# Altium schematic sheet Pyro.SchDoc
size C; SheetNumber: 5; SheetTotal: 7
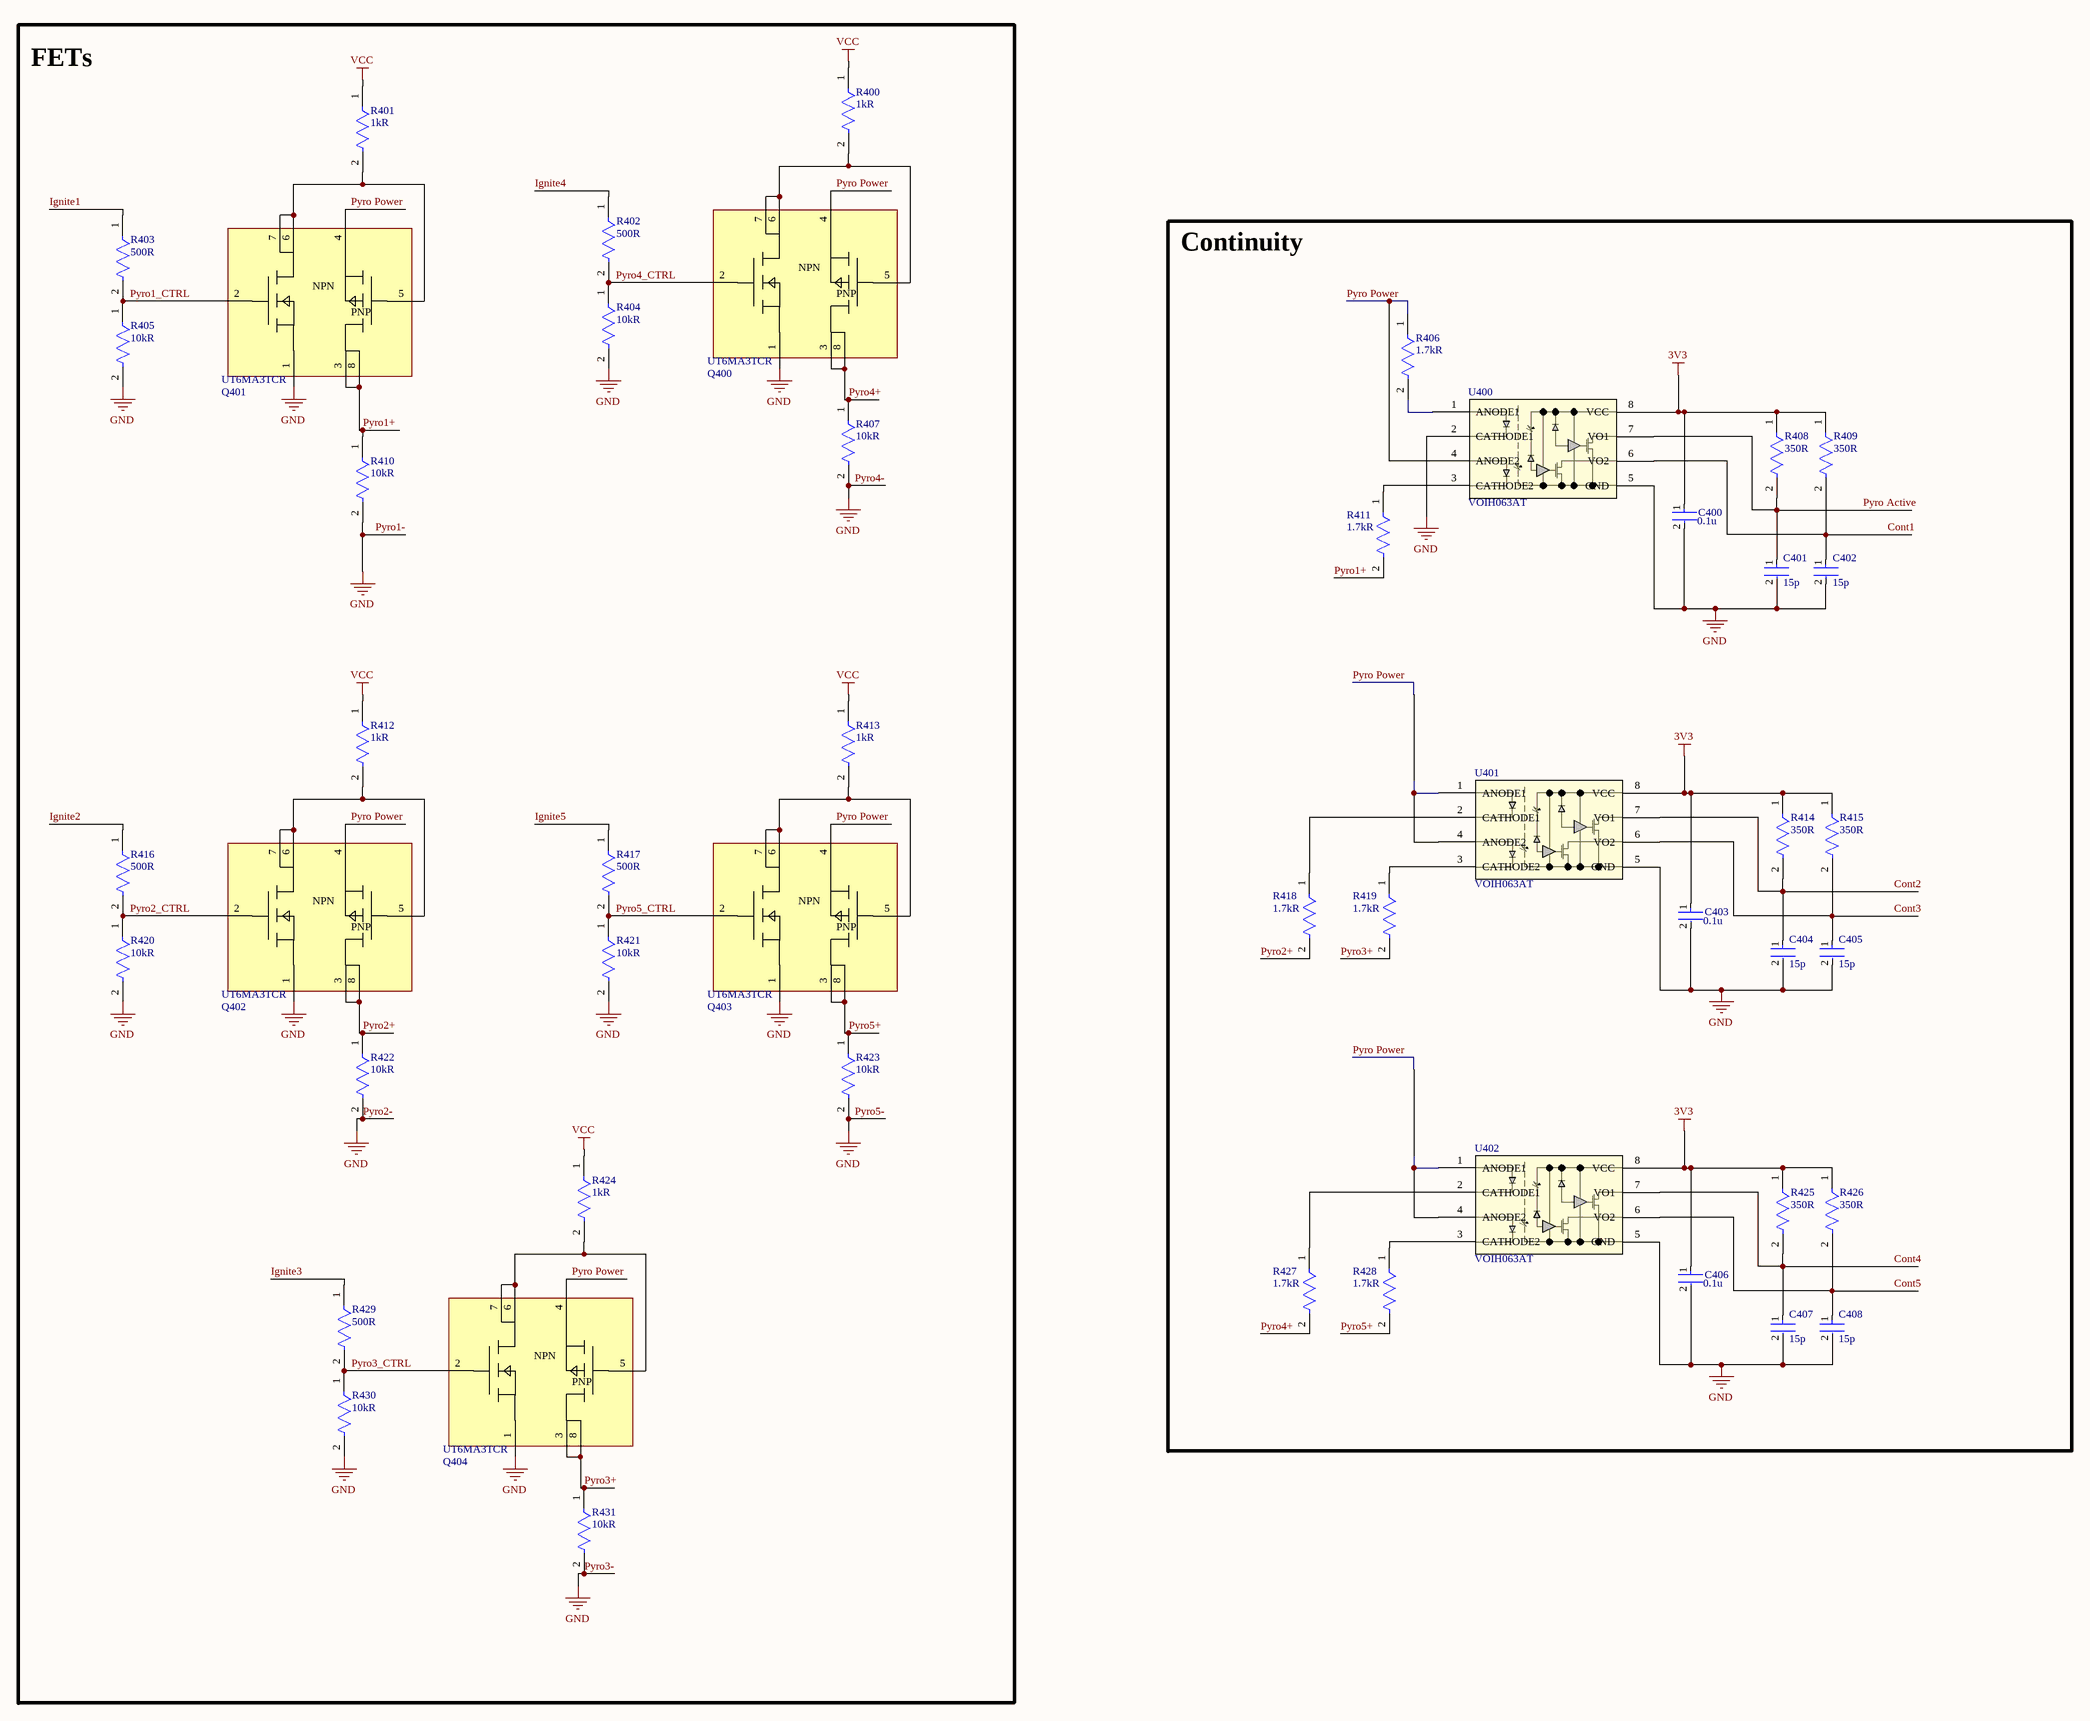
[diagram p0: Pyro.SchDoc]

## Parts
C400  Capacitance: 0.1u  [FP-CL94-IPC_C]  (hidden comment: CL05B104KQ5NNNC)
C401  Capacitance: 15p  [FP-CL10-IPC_A]  (hidden comment: CL10C681JB8NFNC)
C402  Capacitance: 15p  [FP-CL10-IPC_A]  (hidden comment: CL10C681JB8NFNC)
C403  Capacitance: 0.1u  [FP-CL94-IPC_C]  (hidden comment: CL05B104KQ5NNNC)
C404  Capacitance: 15p  [FP-CL10-IPC_A]  (hidden comment: CL10C681JB8NFNC)
C405  Capacitance: 15p  [FP-CL10-IPC_A]  (hidden comment: CL10C681JB8NFNC)
C406  Capacitance: 0.1u  [FP-CL94-IPC_C]  (hidden comment: CL05B104KQ5NNNC)
C407  Capacitance: 15p  [FP-CL10-IPC_A]  (hidden comment: CL10C681JB8NFNC)
C408  Capacitance: 15p  [FP-CL10-IPC_A]  (hidden comment: CL10C681JB8NFNC)
Q400  UT6MA3TCR  [TRANS_UT6J3_ROM]
Q401  UT6MA3TCR  [TRANS_UT6J3_ROM]
Q402  UT6MA3TCR  [TRANS_UT6J3_ROM]
Q403  UT6MA3TCR  [TRANS_UT6J3_ROM]
Q404  UT6MA3TCR  [TRANS_UT6J3_ROM]
R400  value 1kR  [FP-CPF0603-MFG]  (hidden comment: CPF0603B2K15E1)
R401  value 1kR  [FP-CPF0603-MFG]  (hidden comment: CPF0603B2K15E1)
R402  value 500R  [FP-CPF0603-MFG]  (hidden comment: CPF0603B2K15E1)
R403  value 500R  [FP-CPF0603-MFG]  (hidden comment: CPF0603B2K15E1)
R404  value 10kR  [FP-CPF0603-MFG]  (hidden comment: CPF0603B2K15E1)
R405  value 10kR  [FP-CPF0603-MFG]  (hidden comment: CPF0603B2K15E1)
R406  value 1.7kR  [FP-CPF0603-MFG]  (hidden comment: CPF0603B2K15E1)
R407  value 10kR  [FP-CPF0603-MFG]  (hidden comment: CPF0603B2K15E1)
R408  value 350R  [FP-CPF0603-MFG]  (hidden comment: CPF0603B2K15E1)
R409  value 350R  [FP-CPF0603-MFG]  (hidden comment: CPF0603B2K15E1)
R410  value 10kR  [FP-CPF0603-MFG]  (hidden comment: CPF0603B2K15E1)
R411  value 1.7kR  [FP-CPF0603-MFG]  (hidden comment: CPF0603B2K15E1)
R412  value 1kR  [FP-CPF0603-MFG]  (hidden comment: CPF0603B2K15E1)
R413  value 1kR  [FP-CPF0603-MFG]  (hidden comment: CPF0603B2K15E1)
R414  value 350R  [FP-CPF0603-MFG]  (hidden comment: CPF0603B2K15E1)
R415  value 350R  [FP-CPF0603-MFG]  (hidden comment: CPF0603B2K15E1)
R416  value 500R  [FP-CPF0603-MFG]  (hidden comment: CPF0603B2K15E1)
R417  value 500R  [FP-CPF0603-MFG]  (hidden comment: CPF0603B2K15E1)
R418  value 1.7kR  [FP-CPF0603-MFG]  (hidden comment: CPF0603B2K15E1)
R419  value 1.7kR  [FP-CPF0603-MFG]  (hidden comment: CPF0603B2K15E1)
R420  value 10kR  [FP-CPF0603-MFG]  (hidden comment: CPF0603B2K15E1)
R421  value 10kR  [FP-CPF0603-MFG]  (hidden comment: CPF0603B2K15E1)
R422  value 10kR  [FP-CPF0603-MFG]  (hidden comment: CPF0603B2K15E1)
R423  value 10kR  [FP-CPF0603-MFG]  (hidden comment: CPF0603B2K15E1)
R424  value 1kR  [FP-CPF0603-MFG]  (hidden comment: CPF0603B2K15E1)
R425  value 350R  [FP-CPF0603-MFG]  (hidden comment: CPF0603B2K15E1)
R426  value 350R  [FP-CPF0603-MFG]  (hidden comment: CPF0603B2K15E1)
R427  value 1.7kR  [FP-CPF0603-MFG]  (hidden comment: CPF0603B2K15E1)
R428  value 1.7kR  [FP-CPF0603-MFG]  (hidden comment: CPF0603B2K15E1)
R429  value 500R  [FP-CPF0603-MFG]  (hidden comment: CPF0603B2K15E1)
R430  value 10kR  [FP-CPF0603-MFG]  (hidden comment: CPF0603B2K15E1)
R431  value 10kR  [FP-CPF0603-MFG]  (hidden comment: CPF0603B2K15E1)
U400  VOIH063AT  [SOIC-8_VOIH063A_VIS]
U401  VOIH063AT  [SOIC-8_VOIH063A_VIS]
U402  VOIH063AT  [SOIC-8_VOIH063A_VIS]

## Blocks framed on the sheet
FETs: Q400-Q404 R400-R405 R407 R410 R412 R413 R416 R417 R420-R424 R429-R431
Continuity: C400-C408 R406 R408 R409 R411 R414 R415 R418 R419 R425-R428 U400-U402

## Nets
3V3: C400.1 C403.1 C406.1 R408.1 R409.1 R414.1 R415.1 R425.1 R426.1 U400.8(VCC) U401.8(VCC) U402.8(VCC)
Pyro1-: C400.2 C401.2 C402.2 C403.2 C404.2 C405.2 C406.2 C407.2 C408.2 Q400.1 Q401.1 Q402.1 Q403.1 Q404.1 R404.2 R405.2 R407.2 R410.2 R420.2 R421.2 R422.2 R423.2 R430.2 R431.2 U400.2(CATHODE1) U400.5(GND) U401.5(GND) U402.5(GND)  [also labelled GND, Pyro2-, Pyro3-, Pyro4-, Pyro5-]
VCC: R400.1 R401.1 R412.1 R413.1 R424.1
Cont1: C402.1 R409.2 U400.6(VO2)
Cont2: C404.1 R414.2 U401.7(VO1)
Cont3: C405.1 R415.2 U401.6(VO2)
Cont4: C407.1 R425.2 U402.7(VO1)
Cont5: C408.1 R426.2 U402.6(VO2)
Ignite1: R403.1
Ignite2: R416.1
Ignite3: R429.1
Ignite4: R402.1
Ignite5: R417.1
Pyro1+: Q401.3 Q401.8 R410.1 R411.2
Pyro1_CTRL: Q401.2 R403.2 R405.1
Pyro2+: Q402.3 Q402.8 R418.2 R422.1
Pyro2_CTRL: Q402.2 R416.2 R420.1
Pyro3+: Q404.3 Q404.8 R419.2 R431.1
Pyro3_CTRL: Q404.2 R429.2 R430.1
Pyro4+: Q400.3 Q400.8 R407.1 R427.2
Pyro4_CTRL: Q400.2 R402.2 R404.1
Pyro5+: Q403.3 Q403.8 R423.1 R428.2
Pyro5_CTRL: Q403.2 R417.2 R421.1
Pyro Active: C401.1 R408.2 U400.7(VO1)
Pyro Power: Q400.4 Q401.4 Q402.4 Q403.4 Q404.4 R406.1 U400.4(ANODE2) U401.1(ANODE1) U401.4(ANODE2) U402.1(ANODE1) U402.4(ANODE2)
NetQ400_5: Q400.5 Q400.6 Q400.7 R400.2
NetQ401_5: Q401.5 Q401.6 Q401.7 R401.2
NetQ402_5: Q402.5 Q402.6 Q402.7 R412.2
NetQ403_5: Q403.5 Q403.6 Q403.7 R413.2
NetQ404_5: Q404.5 Q404.6 Q404.7 R424.2
NetR406_2: R406.2 U400.1(ANODE1)
NetR411_1: R411.1 U400.3(CATHODE2)
NetR418_1: R418.1 U401.2(CATHODE1)
NetR419_1: R419.1 U401.3(CATHODE2)
NetR427_1: R427.1 U402.2(CATHODE1)
NetR428_1: R428.1 U402.3(CATHODE2)

## Notes on the sheet
- (in symbol CMP-009-00178-3) NPN; PNP

## Library data of the parts
C400 C403 C406 = CMP-13271-000088-1: Cap Ceramic 100nF 6.3V X7R ±10% SMD 0402 +125°C Paper T/R; Tolerance: 10%; Thickness: 0.022inch; Case Code (Metric): 1005; Dielectric: X7R; Case/Package: 0402; Min Operating Temperature: -55°C; Voltage Rating (DC): 6.3V; Radiation Hardening: No; Voltage Rating: 6.3V; Depth: 0.5mm; Length: 1mm; Case Code (Imperial): 0402; Mount: Surface Mount; Width: 0.02inch; Height: 0.5mm; Max Operating Temperature: 125°C; Lead Free: Lead Free; Packaging: Tape and Reel
C401 C402 C404 C405 C407 C408 = CMP-13271-001533-1: Cap Ceramic 680pF 50V C0G ±5% Pad SMD 0603 +125°C T/R; Voltage Rating: 50V; Radiation Hardening: No; Length: 0.063inch; Min Operating Temperature: -55°C; Package Quantity: 1; Lead Free: Lead Free; Case Code (Metric): 1608; Thickness: 0.035inch; Width: 0.031inch; Height: 0.8mm; Case/Package: 0603; Tolerance: 5%; Mount: Surface Mount; Dielectric: C0G; Max Operating Temperature: 125°C; Case Code (Imperial): 0603; Packaging: Tape and Reel; Depth: 0.8mm
Q400-Q404 = CMP-009-00178-3: No Description Available; Mfr_Name: ROHM Semiconductor; Type: Type; Design Item ID: UT6MA3TCR; RefDes: RefDes; Source: UT6MA3TCR.SchLib
R400-R431 = CMP-03211-008657-1: RES SMD 2.15KΩ 0.1% 1/16W 0603; Manufacturer: TE Connectivity; Temperature Coefficient: 25ppm/°C; Voltage Rating: 50V; Power Rating: 0.063W; Height: 0.55mm; Series: CPF; ComponentLink2Description: Datasheet; Package: CPF0603; Automotive: No; octopart_url: https://octopart.com/cpf0603b2k15e1-te+connectivity-22739551; Lead Free: Yes; Temperature: -55°C to +155°C; RoHS: TRUE; Ipc Land Pattern Name: RESC15580X45; Temperature Range Low: -55°C; Composition: Thin Film; Device Class L3: Chip SMD Resistors; Category: Res; Octopart: https://octopart.com/cpf0603b2k15e1-te+connectivity-22739551; Resistance: 2.15KΩ; ComponentLink2URL: https://www.te.com/commerce/DocumentDelivery/DDEController?Action=showdoc&DocId=Data+Sheet%7F1773200%7FM%7Fpdf%7FEnglish%7FENG_DS_1773200_M.pdf%7F3-1676481-2; Manufacturer Part Number: CPF0603B2K15E1; packaging: 1k Reel; Tolerance: 0.1%; Temperature Range High: +155°C; Device Class L1: Passive Components; Device Class L2: Resistors
U400-U402 = CMP-053-000000-3: No Description Available; Mfr_Name: Vishay; RefDes: RefDes; Type: Type; Source: VOIH063AT.SchLib; Design Item ID: VOIH063AT